# Altium schematic sheet photodiode-amplifier.SchDoc: Photodiode Transimpedance Amplifier
size A4; DrawnBy: Dylan Vogel; Organization: UTAT SS; DocumentNumber: 11; Revision: 2; SheetNumber: 11; SheetTotal: 13
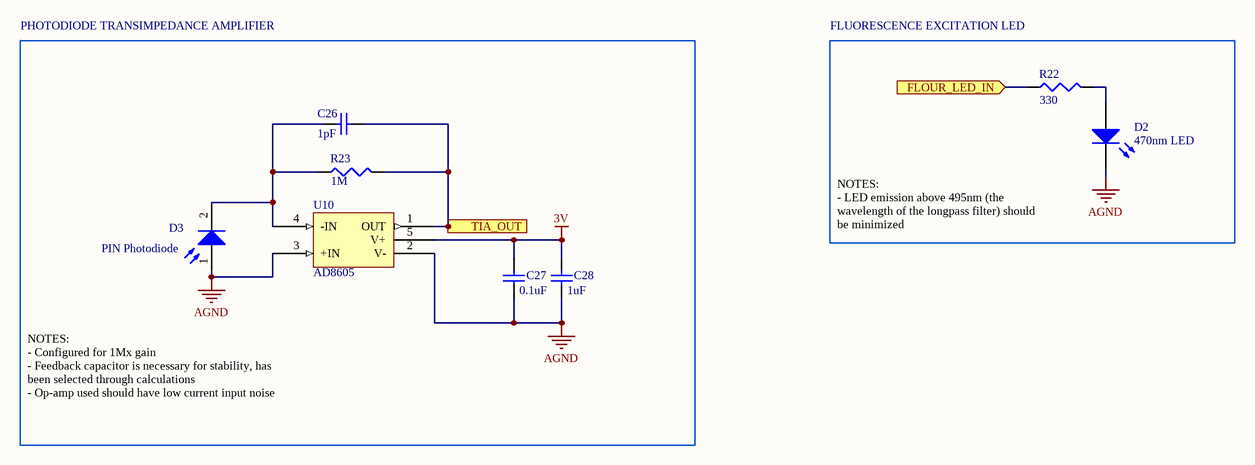
[diagram p0: photodiode-amplifier.SchDoc]

## Parts
C26  1pF  [0402]
C27  0.1uF  [0402]
C28  1uF  [1608[0603]]
D2  470nm LED  [LB P4SG]
D3  PIN Photodiode  [VBPW34SR]
R22  330  [0402]
R23  1M  [J1-0603]
U10  AD8605  [SOP-65P200X125-5N]

## Blocks framed on the sheet
PHOTODIODE TRANSIMPEDANCE AMPLIFIER: C26-C28 D3 R23 U10
FLUORESCENCE EXCITATION LED: D2 R22

## Ports
FLOUR_LED_IN (in), TIA_OUT (out)

## Nets
3V: C27.2 C28.2 U10.5(V+)
AGND: C27.1 C28.1 D2.2(K) D3.1(A) U10.2(V-) U10.3(+IN)
FLOUR_LED_IN: R22.1 ; port FLOUR_LED_IN
TIA_OUT: C26.2 R23.2 U10.1(OUT) ; port TIA_OUT
NetC26_1: C26.1 D3.2(K) R23.1 U10.4(-IN)
NetD2_1: D2.1(A) R22.2

## Notes on the sheet
- NOTES:
  - LED emission above 495nm (the wavelength of the longpass filter) should be minimized
- NOTES:
  - Configured for 1Mx gain
  - Feedback capacitor is necessary for stability, has been selected through calculations
  - Op-amp used should have low current input noise

## Library data of the parts
C26 = Cap Semi: Feedback capacitor; Published: 8-Jun-2000; LatestRevisionDate: 29-May-2009; LatestRevisionNote: IPC-7351 Footprint Added.; PackageReference: C1206; Publisher: Altium Limited; PackageDescription: Chip Capacitor; Value: 1pF; Supplier: Digi-Key; Supplier 1: Digi-Key
C27 C28 = Cap Semi: Capacitor (Semiconductor SIM Model); Published: 8-Jun-2000; LatestRevisionDate: 29-May-2009; LatestRevisionNote: IPC-7351 Footprint Added.; PackageReference: C1206; Publisher: Altium Limited; PackageDescription: Chip Capacitor; Supplier: Digi-Key; Supplier 1: Digi-Key
  C27: Value: 0.1uF
  C28: Value: 1uF
D2 = LED2: Typical RED, GREEN, YELLOW, AMBER GaAs LED; Published: 8-Jun-2000; LatestRevisionDate: 17-Jul-2002; LatestRevisionNote: Re-released for DXP Platform.; PackageVersion: Feb-2002; PackageReference: 3.2X1.6X1.1; Publisher: Altium Limited; PackageDescription: SM LED; 2 Flat Leads; Supplier Part Number: 475-2814-1-ND; Supplier: Digi-Key; Supplier 1: Digi-Key
D3 = Photo Sen: Photosensitive Diode; Published: 24-Mar-1999; LatestRevisionDate: 17-Jul-2002; LatestRevisionNote: Re-released for DXP Platform.; PackageReference: PIN2; Publisher: Altium Limited; Supplier Part Number: 751-1501-1-ND; Supplier: Digi-Key; Supplier 1: Digi-Key
R22 = Res3: Resistor; Published: 8-Jun-2000; LatestRevisionDate: 29-May-2009; LatestRevisionNote: IPC-7351 Footprint Added.; PackageReference: J1-0603; Publisher: Altium Limited; PackageDescription: Chip Resistor; Value: 330; Supplier: Digi-Key; Supplier 1: Digi-Key
R23 = Res3: 1 MOhm resistor for photodiode gain; Published: 8-Jun-2000; LatestRevisionDate: 29-May-2009; LatestRevisionNote: IPC-7351 Footprint Added.; PackageReference: J1-0603; Publisher: Altium Limited; PackageDescription: Chip Resistor; Value: 1M; Supplier: Digi-Key; Supplier 1: Digi-Key
U10 = AD8605: Low noise, precision rail-to-rail op-amp.; Supplier 1: Digi-Key; Supplier Part Number 1: AD8605ARTZREEL7CT-ND; Supplier: Digi-Key